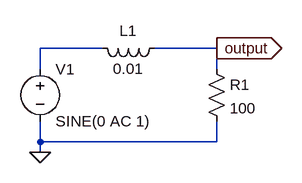
[diagram p0: schematic rl_lowpass.asc]
rl_lowpass.asc, the LTspice schematic file:
Version 4
SHEET 1 880 680
WIRE 224 112 128 112
WIRE 400 112 304 112
WIRE 128 144 128 112
WIRE 400 144 400 112
WIRE 128 256 128 224
WIRE 400 256 400 224
WIRE 400 256 128 256
WIRE 128 272 128 256
FLAG 128 272 0
FLAG 400 112 output
IOPIN 400 112 Out
SYMBOL voltage 128 128 R0
WINDOW 123 0 0 Left 0
WINDOW 39 0 0 Left 0
SYMATTR InstName V1
SYMATTR Value SINE(0 AC 1)
SYMBOL ind 320 96 R90
WINDOW 0 5 56 VBottom 2
WINDOW 3 32 56 VTop 2
SYMATTR InstName L1
SYMATTR Value 0.01
SYMBOL res 384 128 R0
SYMATTR InstName R1
SYMATTR Value 100

The netlist it stands for:
* rl_lowpass.asc
V1 N001 0 SINE(0 AC 1)
L1 output N001 0.01
R1 output 0 100
.backanno
.end